# Altium schematic sheet Sheet1.SchDoc
size A
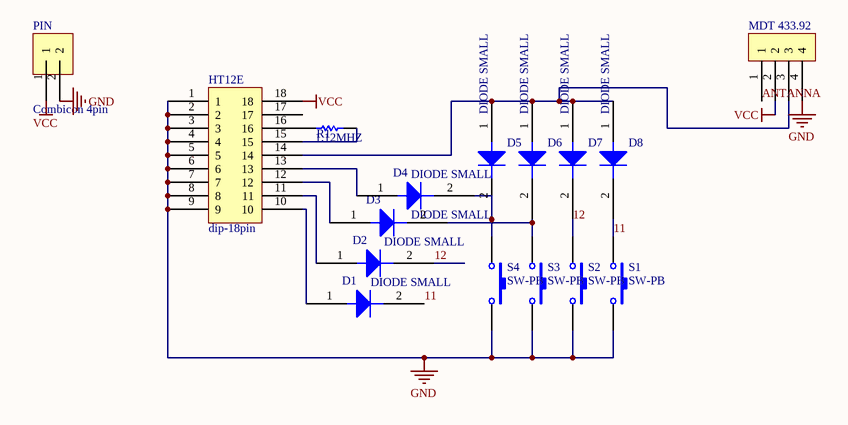
[diagram p0: Sheet1.SchDoc]

## Parts
D1  DIODE SMALL  [diode small]
D2  DIODE SMALL  [diode small]
D3  DIODE SMALL  [diode small]
D4  DIODE SMALL  [diode small]
D5  DIODE SMALL  [diode small]
D6  DIODE SMALL  [diode small]
D7  DIODE SMALL  [diode small]
D8  DIODE SMALL  [diode small]
HT12E  dip-18pin  [dip-18pin]
MDT_433.92  (no value)  [PCBComponent_1]
PIN  Combicon 4pin  [combicon-2pin_black]
R1  1.12MHZ  [res- 2.54x3]
S1  SW-PB  [sw-pb]
S2  SW-PB  [sw-pb]
S3  SW-PB  [sw-pb]
S4  SW-PB  [sw-pb]

## Nets
GND: HT12E.1 HT12E.2 HT12E.3 HT12E.4 HT12E.5 HT12E.6 HT12E.7 HT12E.8 HT12E.9 MDT_433.92.4 PIN.2 S1.2 S2.2 S3.2 S4.2
VCC: HT12E.18 MDT_433.92.2 PIN.1
11: D1.2 D8.2 S1.1
12: D2.2 D7.2 S2.1
ANTANNA: MDT_433.92.1
NetD1_1: D1.1 HT12E.10
NetD2_1: D2.1 HT12E.11
NetD3_1: D3.1 HT12E.12
NetD3_2: D3.2 D6.2 S3.1
NetD4_1: D4.1 HT12E.13
NetD4_2: D4.2 D5.2 S4.1
NetD5_1: D5.1 D6.1 D7.1 D8.1 HT12E.14 MDT_433.92.3
NetHT12E_15: HT12E.15 R1.2
NetHT12E_16: HT12E.16 R1.1

Not connected (* = marked no-connect by the designer): HT12E 17

## Library data of the parts
MDT_433.92 = Component_1
PIN = Combicon - 2 pin_black
R1 = Resistor 2.54x3
S1-S4 = SW-PB: Switch; Published: 24-Mar-1999; LatestRevisionDate: 17-Jul-2002; LatestRevisionNote: Re-released for DXP Platform.; PackageReference: SPST-2; Publisher: Altium Limited